# EAGLE design PomodoroClock (EAGLE 9.6.2)
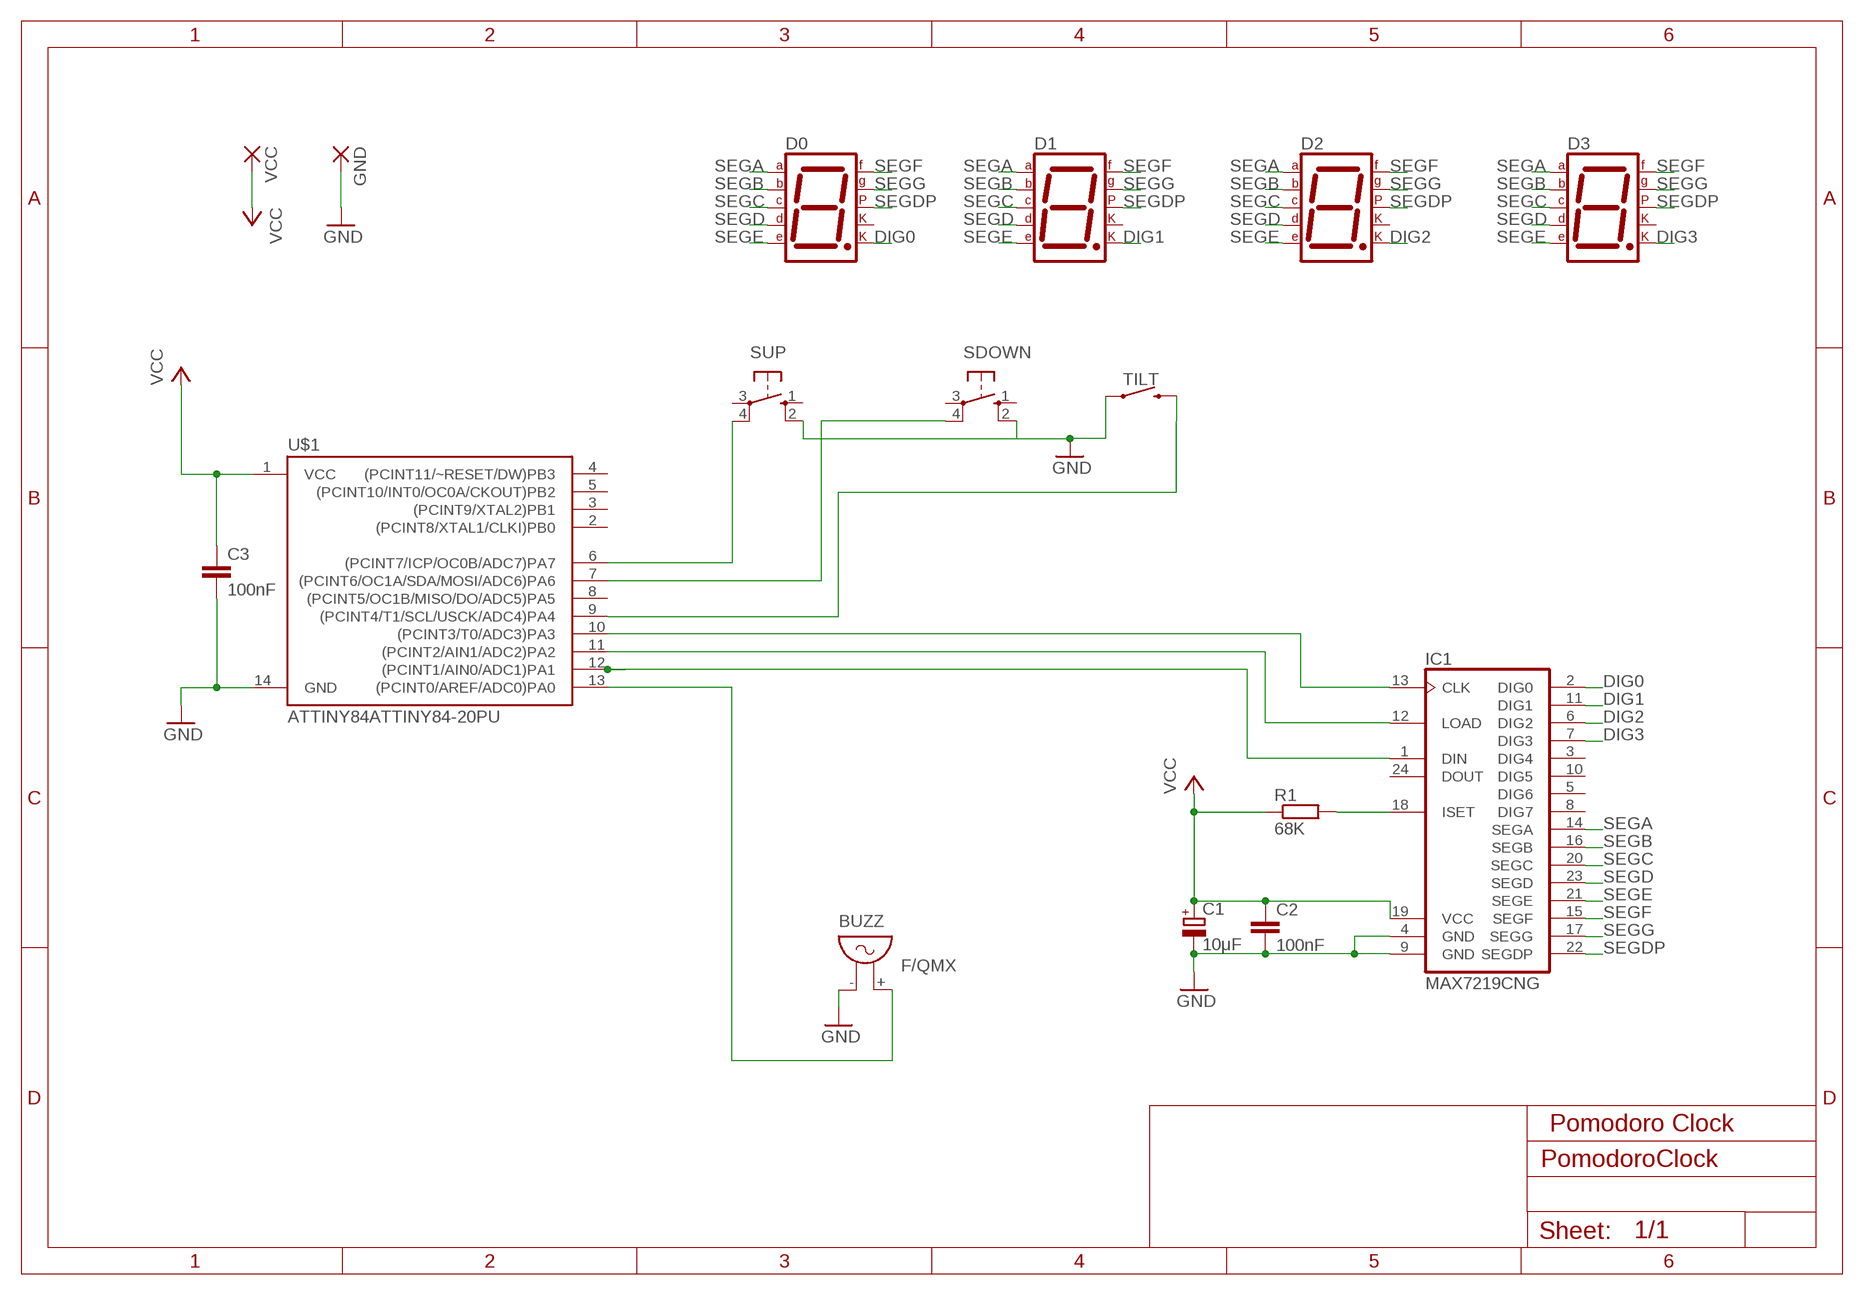
[diagram p0: schematic, sheet 1]

## Parts
BUZZ  F/QMX  [F/QMX]
C1  10μF  CPOL-EUE2,5-6E  [E2,5-6E]
C2  100nF  C-EU025-025X050  [C025-025X050]
C3  100nF  C-EU025-025X050  [C025-025X050]
D0  7SEG-CK  [7SEG-13]
D1  7SEG-CK  [7SEG-13]
D2  7SEG-CK  [7SEG-13]
D3  7SEG-CK  [7SEG-13]
GND  3,81/1,4  [3,81/1,4]
IC1  MAX7219CNG  [DIL24-3]
R1  68K  R-EU_0207/10  [0207/10]
SDOWN  10-XX  [B3F-10XX]
SUP  10-XX  [B3F-10XX]
TILT  TILT  [TILT]
U$1  ATTINY84ATTINY84-20PU  [DIP14]
VCC  3,81/1,4  [3,81/1,4]

## Nets
DIG0: D0.8(CK2) IC1.2(DIG0)
DIG1: D1.8(CK2) IC1.11(DIG1)
DIG2: D2.8(CK2) IC1.6(DIG2)
DIG3: D3.8(CK2) IC1.7(DIG3)
GND: BUZZ.- C1.- C2.2 C3.2 GND.1(P) IC1.4(GND) IC1.9(GND) SDOWN.2(S1) SUP.2(S1) TILT.1 U$1.14(GND)
N$1: IC1.13(CLK) U$1.10((PCINT3/T0/ADC3)PA3)
N$2: IC1.12(LOAD) U$1.11((PCINT2/AIN1/ADC2)PA2)
N$3: IC1.1(DIN) U$1.12((PCINT1/AIN0/ADC1)PA1)
N$4: BUZZ.+ U$1.13((PCINT0/AREF/ADC0)PA0)
N$5: SUP.4(P1) U$1.6((PCINT7/ICP/OC0B/ADC7)PA7)
N$6: SDOWN.4(P1) U$1.7((PCINT6/OC1A/SDA/MOSI/ADC6)PA6)
N$7: IC1.18(ISET) R1.2
SEGA: D0.7(A) D1.7(A) D2.7(A) D3.7(A) IC1.14(SEGA)
SEGB: D0.6(B) D1.6(B) D2.6(B) D3.6(B) IC1.16(SEGB)
SEGC: D0.4(C) D1.4(C) D2.4(C) D3.4(C) IC1.20(SEGC)
SEGD: D0.2(D) D1.2(D) D2.2(D) D3.2(D) IC1.23(SEGD)
SEGDP: D0.5(DP) D1.5(DP) D2.5(DP) D3.5(DP) IC1.22(SEGDP)
SEGE: D0.1(E) D1.1(E) D2.1(E) D3.1(E) IC1.21(SEGE)
SEGF: D0.9(F) D1.9(F) D2.9(F) D3.9(F) IC1.15(SEGF)
SEGG: D0.10(G) D1.10(G) D2.10(G) D3.10(G) IC1.17(SEGG)
TILT: TILT.2 U$1.9((PCINT4/T1/SCL/USCK/ADC4)PA4)
VCC: C1.+ C2.1 C3.1 IC1.19(VCC) R1.1 U$1.1(VCC) VCC.1(P)
Unconnected: D0.3(CK1) D1.3(CK1) D2.3(CK1) D3.3(CK1) IC1.3(DIG4) IC1.5(DIG6) IC1.8(DIG7) IC1.10(DIG5) IC1.24(DOUT) SDOWN.1(S) SDOWN.3(P) SUP.1(S) SUP.3(P) U$1.2((PCINT8/XTAL1/CLKI)PB0) U$1.3((PCINT9/XTAL2)PB1) U$1.4((PCINT11/~RESET/DW)PB3) U$1.5((PCINT10/INT0/OC0A/CKOUT)PB2) U$1.8((PCINT5/OC1B/MISO/DO/ADC5)PA5)

## Notes on the sheet
- Pomodoro Clock

## Library data of the parts
BUZZ = buzzer:F/QMX: BUZZER Source: Buerklin; OC_FARNELL: unknown; OC_NEWARK: unknown
C1 = rcl:CPOL-EU: POLARIZED CAPACITOR, European symbol; SPICEPREFIX: C
C2 C3 = rcl:C-EU: CAPACITOR, European symbol; SPICEPREFIX: C
D0 D1-D3 = special:7SEG-CK: 7-segment DISPLAY single cathode, 13 mm
GND VCC = wirepad:3,81/1,4: THROUGH-HOLE PAD
IC1 = maxim:MAX7219CNG: LED DISPLAY DRIVER; MF: MAXIM; MPN: MAX7219CNG; OC_FARNELL: 1523914; OC_NEWARK: 34C4018
R1 = rcl:R-EU_: RESISTOR, European symbol; SPICEPREFIX: R
SDOWN SUP = switch-omron:10-XX: OMRON SWITCH; MPN: B3F-1000; OC_FARNELL: 176432; OC_NEWARK: 36M3542
TILT = my-library:TILT: Rolling Ball Tilt Switch 107-2006-EV Electrical Specifications: • Maximum switch rating: <6mA 24VDC • Electrical life endurance: >50000 cycles • Contact Resistance: 2Ω (measured at 45° tilt) Mechanical Specifications: • Differential angle: 30° max. • Operation temperature: 0°C ~ 100°C Materials: • Switch housing: Copper coated with nickel (10μ) • Terminal: Brass coated with nickel • Rolling ball: Brass coated with nickel Balll weighted 0.25g Note: • RoHS Compliant Dimensions: mm (In.) Available from Mouser Electronics Soldering Process: • Temperature: 250°C, 3 seconds (Can be soldered by hand only.)
U$1 = SparkFun-IC-Microcontroller:ATTINY84: Atmel 14-pin 2/4/8kB flash uC Datasheet <https://cdn.sparkfun.com/datasheets/Widgets/doc8006.pdf> SparkFun Products Tiny AVR Programmer <https://www.sparkfun.com/products/11801> (PGM-11801) SparkFun Servo Trigger - Continuous Rotation <https://www.sparkfun.com/products/13872> (WIG-13872) SparkFun Servo Trigger <https://www.sparkfun.com/products/13118> (WIG-13118)

## Board
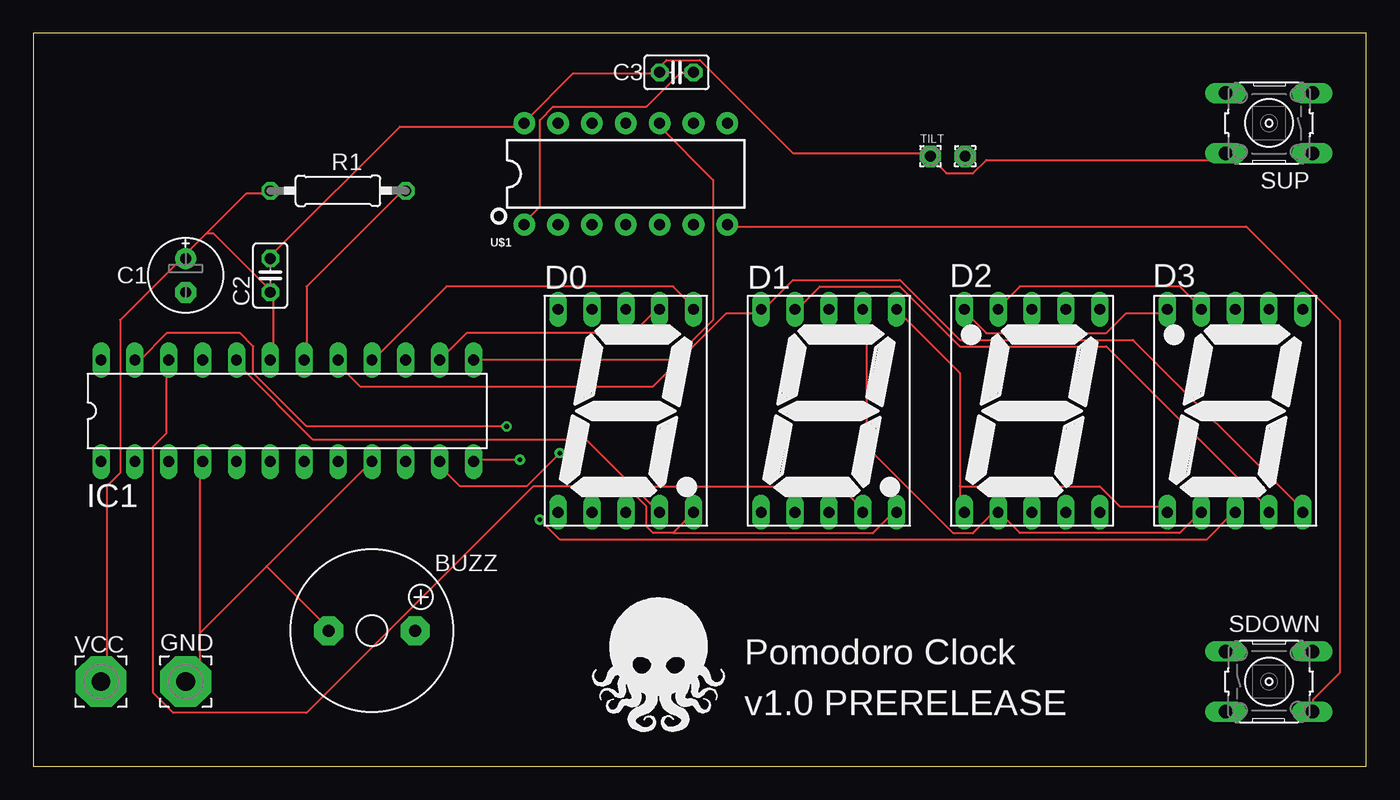
[diagram p1: board, top side]
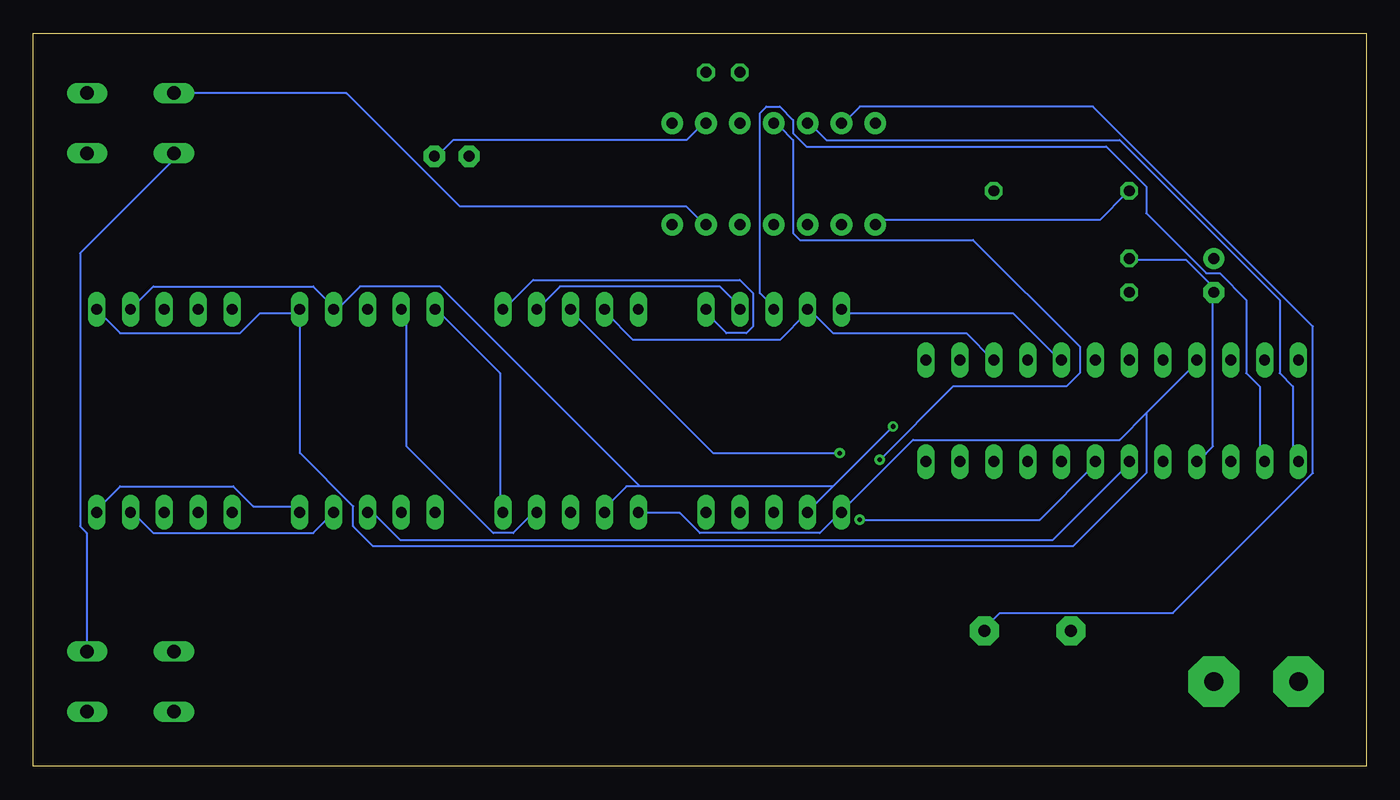
[diagram p2: board, bottom side, seen from below]

Size 100 x 55 mm. Coordinates in mm from the lower left corner, seen from the top.
Outline: 0,0 100,0 100,55 0,55 0,0
Copper layers (1*16): Top 0.035mm / dielectric 1.5mm / Bottom 0.035mm
Design rules "default": minimum track width 6mil, minimum drill 0.35mm, track to track 6mil, track to pad 6mil, pad to pad 6mil, via to via 6mil, smd to smd 6mil, copper to edge 40mil, drill to drill 6mil, minimum pad ring 10mil, minimum via ring 8mil, stop-mask expansion 4mil, vias tented up to drill 0mil, thermal gap 10mil

### Footprints (pad centres in the part's own frame; a part is rotated, then mirrored left to right if it is on the bottom)
F/QMX = drill 0.914 pad 2.159 octagon: + 3.251,0; - -3.251,0
E2,5-6E = drill 0.813 pad 1.575: + -1.27,0 | drill 0.813 pad 1.575 octagon: - 1.27,0
C025-025X050 = drill 0.813 octagon: 1 -1.27,0; 2 1.27,0
7SEG-13 = drill 0.813 long: 1 -5.08,-7.62; 2 -2.54,-7.62; 3 0,-7.62; 4 2.54,-7.62; 5 5.08,-7.62; 6 5.08,7.62; 7 2.54,7.62; 8 0,7.62; 9 -2.54,7.62; 10 -5.08,7.62
3,81/1,4 = drill 1.397 pad 3.81 octagon: 1 0,0
DIL24-3 = drill 0.813 long: 1 -13.97,-3.81; 2 -11.43,-3.81; 3 -8.89,-3.81; 4 -6.35,-3.81; 5 -3.81,-3.81; 6 -1.27,-3.81; 7 1.27,-3.81; 8 3.81,-3.81; 9 6.35,-3.81; 10 8.89,-3.81; 11 11.43,-3.81; 12 13.97,-3.81; 13 13.97,3.81; 14 11.43,3.81; 15 8.89,3.81; 16 6.35,3.81; 17 3.81,3.81; 18 1.27,3.81; 19 -1.27,3.81; 20 -3.81,3.81; 21 -6.35,3.81; 22 -8.89,3.81; 23 -11.43,3.81; 24 -13.97,3.81
0207/10 = drill 0.813 octagon: 1 -5.08,0; 2 5.08,0
B3F-10XX = drill 1.016 long: 1 -3.251,2.261; 2 3.251,2.261; 3 -3.251,-2.261; 4 3.251,-2.261
TILT = drill 0.813 pad 1.6 octagon: 1 0,0.05; 2 2.6,0.05
DIP14 = drill 0.813 pad 1.626: 1 -7.62,-3.81; 2 -5.08,-3.81; 3 -2.54,-3.81; 4 0,-3.81; 5 2.54,-3.81; 6 5.08,-3.81; 7 7.62,-3.81; 8 7.62,3.81; 9 5.08,3.81; 10 2.54,3.81; 11 0,3.81; 12 -2.54,3.81; 13 -5.08,3.81; 14 -7.62,3.81

### Placement (x,y rotation side)
BUZZ  25.4,10.16 0 top
C1  11.43,36.83 270 top
C2  17.78,36.83 90 top
C3  48.26,52.07 180 top
D0  44.45,26.67 0 top
D1  59.69,26.67 0 top
D2  74.93,26.67 180 top
D3  90.17,26.67 180 top
GND  11.43,6.35 0 top
IC1  19.05,26.67 0 top
R1  22.86,43.18 0 top
SDOWN  92.71,6.35 0 top
SUP  92.71,48.26 180 top
TILT  67.31,45.72 0 top
U$1  44.45,44.45 0 top
VCC  5.08,6.35 0 top

### Tracks (layer width: path | path; a pad name or v marks a point on that pad's centre or on a via)
DIG0
  Bottom 0.152: IC1.2 8,23 8,28.5 9,29.5 9,35 11,37 12,37 16.5,41.5 16.5,43.5 19.5,46.5 42,46.5 43,47.5 43,48.5 44,49.5 45,49.5 45.5,49 45.5,35.5 44.5,34.5 D0.8
DIG1  (via drill 0.35)
  Top 0.152: v39.5,23.5 37,21 32,21 30.5,22.5 IC1.11
  Bottom 0.152: v39.5,23.5 49,23.5 59.5,34 D1.8
DIG2
  Bottom 0.152: IC1.6 18,22.5 23.5,17 72.5,17 74.5,19 D2.8
DIG3  (via drill 0.35)
  Top 0.152: v38,18.5 39.5,17 88,17 90,19 D3.8
  Bottom 0.152: v38,18.5 24.5,18.5 20.5,22.5 IC1.7
GND
  Top 0.152: SUP.2 89,45.5 71.5,45.5 70.5,44.5 68.5,44.5 67.5,45.5 TILT.1 67,46 57,46 50,53 47.5,53 47,52.5 C3.2 46.5,52 40.5,52 37,48.5 U$1.14 36.5,48 27.5,48 18,38.5 C2.2 | 12.5,10 12.5,7.5 11.5,6.5 GND.1 | 12.5,10 12.5,22.5 IC1.4 | 12.5,10 17.5,15 | 17.5,15 25,22.5 IC1.9 | 17.5,15 22,10.5 BUZZ.-
  Bottom 0.152: SDOWN.2 96,8.77 96,17.5 96.5,18 96.5,38.5 89.5,45.5 SUP.2 | C2.2 17.5,38 13.5,38 11.5,36 C1.- 11.5,35.5 11.5,24 12.5,23 IC1.4
N$1
  Top 0.152: IC1.13 33.5,30.5 48,30.5 51,33.5 51,44 47,48 U$1.10
N$2  (via drill 0.35)
  Top 0.152: v36.5,23 33.5,23 IC1.12
  Bottom 0.152: v36.5,23 31,28.5 22.5,28.5 21.5,29.5 21.5,31.5 29.5,39.5 42.5,39.5 43,40 43,47 44,48 U$1.11
N$3
  Bottom 0.152: IC1.1 5.5,23 5.5,28.5 6.5,29.5 6.5,35 18.5,47 40.5,47 41.5,48 U$1.12
N$4
  Bottom 0.152: U$1.13 39,48.5 38,49.5 20.5,49.5 4,33 4,22 14.5,11.5 27.5,11.5 28.5,10.5 BUZZ.+
N$5
  Bottom 0.152: SUP.4 89,50.5 76.5,50.5 68,42 51,42 50,41 U$1.6
N$6
  Top 0.152: SDOWN.4 96,4.27 96,5 98,7 98,33.5 91,40.5 52.5,40.5 U$1.7
N$7
  Top 0.152: IC1.18 20.5,30.5 20.5,36 27.5,43 R1.2
SEGA
  Top 0.152: D3.7 87.5,19 86,17.5 74,17.5 72.5,19 D2.7 72,19 70.5,17.5 69,17.5 62.5,24 62.5,34 D1.7 | IC1.14 32.5,32.5 45,32.5 46.5,34 D0.7
  Bottom 0.152: D1.7 62,34.5 60.5,36 48.5,36 47,34.5 D0.7
SEGB
  Top 0.152: IC1.16 25.5,30.5 31,36 48,36 49.5,34.5 D0.6 | 69.5,21 69.5,29.5 65,34 D1.6 | 69.5,21 69.5,19.5 D2.6 | 69.5,21 80,21 81.5,19.5 85,19.5 D3.6
  Bottom 0.152: D0.6 49.5,34 48,32.5 46.5,32.5 46,33 46,35.5 47,36.5 62.5,36.5 64.5,34.5 D1.6
SEGC
  Top 0.152: D2.4 72.5,34.5 74,36 86,36 87.5,34.5 D3.4 | 45,21 46.5,19.5 D0.4 | 45,21 41.5,24.5 21,24.5 15.5,30 IC1.20 | 45,21 60.5,21 62,19.5 D1.4
  Bottom 0.152: D2.4 72,34 72,24 65.5,17.5 64,17.5 62.5,19 D1.4
SEGD  (via drill 0.35)
  Top 0.152: v35.5,25.5 20.5,25.5 16.5,29.5 16.5,31.5 15.5,32.5 10,32.5 8,30.5 IC1.23
  Bottom 0.152: D3.2 91,36 79,36 77.5,34.5 D2.2 77,34.5 75.5,36 69.5,36 54.5,21 | 40,21 41.5,19.5 D0.2 | 40,21 v35.5,25.5 | 40,21 54.5,21 | 54.5,21 55.5,21 57,19.5 D1.2
SEGDP
  Top 0.152: D3.5 85,34 82,34 80.5,32.5 71.5,32.5 70,34 D2.5 | 48,17.5 46.5,17.5 46,18 46,19.5 44.5,21 37.5,21 20.5,4 10.5,4 9,5.5 9,24 10,25 10,30 IC1.22 | 48,17.5 49.5,19 D0.5 | 48,17.5 63,17.5 64.5,19 D1.5
  Bottom 0.152: D1.5 65,19.5 65,29.5 69.5,34 D2.5
SEGE
  Bottom 0.152: D3.1 95,34 93.5,32.5 84.5,32.5 83,34 80.5,34 D2.1 80,34 80,23.5 76,19.5 76,18 74.5,16.5 22,16.5 16.5,22 16.5,26.5 | 16.5,26.5 18.5,24.5 34,24.5 39,19.5 D0.1 39.5,19 41,17.5 50,17.5 51.5,19 54.5,19 D1.1 | 16.5,26.5 13,30 IC1.21
SEGF
  Top 0.152: D3.9 92.5,19.5 80.5,31.5 69.5,31.5 65,36 59,36 57.5,34.5 D1.9
  Bottom 0.152: D2.9 77.5,19 79,17.5 91,17.5 92.5,19 D3.9 | IC1.15 28,30.5 30,32.5 40,32.5 41.5,34 D0.9 42,34 44,32 55,32 57,34 D1.9
SEGG
  Top 0.152: IC1.17 23,30 24.5,28.5 46.5,28.5 52,34 54.5,34 D1.10 55,34.5 57,36.5 65,36.5 69.5,32 82.5,32 95,19.5 D3.10
  Bottom 0.152: D2.10 80.5,19.5 83.5,19.5 85,21 93.5,21 95,19.5 D3.10 | IC1.17 23,30.5 26.5,34 39,34 D0.10
TILT
  Bottom 0.152: TILT.2 69.5,46 68.5,47 51,47 50,48 U$1.9
VCC
  Top 0.152: C3.1 49.5,52 48.5,52 46,49.5 39,49.5 38,48.5 38,42 37,41 U$1.1 | IC1.19 18,30.5 18,35.5 C2.1 17.5,36 13.5,40 13,40 | 13,40 11.5,38.5 C1.+ 11,38 6.5,33.5 6.5,22 5.5,21 5.5,6.5 VCC.1 | 13,40 16,43 17.5,43 R1.1
  Bottom 0.152: U$1.1 36.5,41 20,41 18,43 R1.1

### Text on the board
tPlace: Pomodoro Clock | v1.0 PRERELEASE